# Altium schematic sheet lab2_Kondrashova_buck_boost.SchDoc: =title_line_1 + title_line_2
size 420 x 297 mm; SheetNumber: n
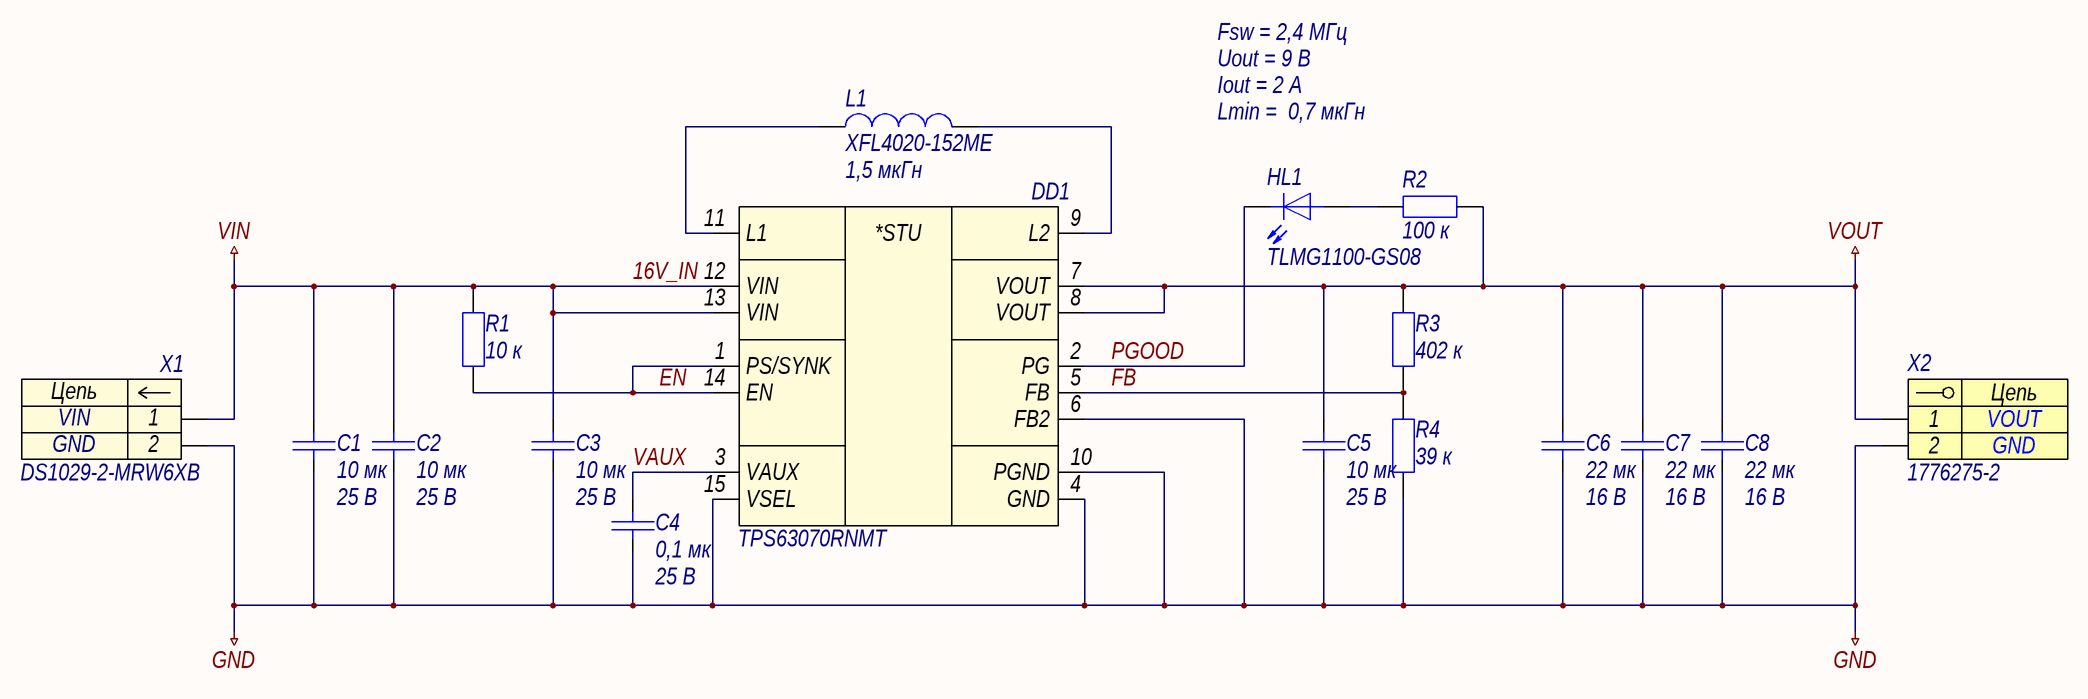
[diagram p0: lab2_Kondrashova_buck_boost.SchDoc]

## Parts
C1  10 мк  Напряжение: 25 В  [C1206]
C2  10 мк  Напряжение: 25 В  [C1206]
C3  10 мк  Напряжение: 25 В  [C0603]
C4  0,1 мк  Напряжение: 25 В  [C0402]
C5  10 мк  Напряжение: 25 В  [C0603]
C6  22 мк  Напряжение: 16 В  [C0805]
C7  22 мк  Напряжение: 16 В  [C0805]
C8  22 мк  Напряжение: 16 В  [C0805]
DD1  TPS63070RNMT  [VQFN-HR-15]
HL1  TLMG1100-GS08  [HL0603]
L1  XFL4020-152ME  Индуктивность: 1,5 мкГн  [XFL-2-400X400X210]
R1  10 к  [R0603]
R2  100 к  [R0603]
R3  402 к  [R0603]
R4  39 к  [R0603]
X1  DS1029-2-MRW6XB  [DS1029-2-MRW6XB]
X2  1776275-2  [1776275-2]

## Nets
16V_IN: C1.1 C2.1 C3.1 DD1.12(VIN) DD1.13(VIN) R1.1 X1.1  [also labelled VIN]
GND: C1.2 C2.2 C3.2 C4.2 C5.2 C6.1 C7.1 C8.1 DD1.4(GND) DD1.6(FB2) DD1.10(PGND) DD1.15(VSEL) R4.2 X1.2 X2.2
VOUT: C5.1 C6.2 C7.2 C8.2 DD1.7(VOUT) DD1.8(VOUT) R2.1 R3.1 X2.1
EN: DD1.1(PS/SYNK) DD1.14(EN) R1.2
FB: DD1.5(FB) R3.2 R4.1
PGOOD: DD1.2(PG) HL1.1
VAUX: C4.1 DD1.3(VAUX)
NetDD1_9: DD1.9(L2) L1.2
NetDD1_11: DD1.11(L1) L1.1
NetHL1_2: HL1.2 R2.2

## Notes on the sheet
- Fsw = 2,4 МГц
- Uout = 9 В
- Iout = 2 А
- Lmin =  0,7 мкГн
- Перв. примен.
- Справ. №
- Подп. и дата
- Инв. № дубл.
- Нормоконтроль:
- Взам. инв. №
- Изм.
- Лист
- № докум.
- Подп.
- Дата
- Лит.
- Масса
- Масштаб
- Т.контр.
- Пров.
- Разраб.
- Листов
- Разработал:
- Инв. № подл.
- Н.контр.
- Утв.
- Копировал
- Формат
- А3
- (in symbol dd0014) *STU
- (in symbol x0005) Цепь
- (in symbol x0007) Цепь

## Library data of the parts
C1 C2 = c0095: =Описание; ID: c0095; Фамилия: Паньков; Описание: Конденсатор чип 1206 10 мкФ 25 В ±10 %; Наименование: CC1206KRX7R8BB475; Производитель: YAGEO Corp.; Отклонение: ±10 %; Рабочие температуры: от –55 °С до +125 °С; Температурный коэффициент емкости: X7R; Корпус: 1206; Номинал: 10 мк; Номинальное напряжение: 25 В; HelpURL: https://www.yageo.com/upload/media/product/productsearch/datasheet/mlcc/UPY-GPHC_X7R_6.3V-to-50V_20.pdf
C3 C5 = c0090: =Описание; ID: c0090; Фамилия: Паньков; Описание: Конденсатор чип 0603 10 мкФ 25 В ±10 %; Наименование: CC0603KRX5R8BB106; Производитель: YAGEO Corp.; Отклонение: ±10 %; Рабочие температуры: от –55 °С до +85 °С; Температурный коэффициент емкости: X5R; Корпус: 0603; Номинал: 10 мк; Номинальное напряжение: 25 В; HelpURL: https://www.yageo.com/upload/media/product/productsearch/datasheet/mlcc/UPY-GPHC_X5R_4V-to-50V_26.pdf
C4 = c0029: =Описание; ID: c0029; Фамилия: Паньков; Описание: Конденсатор чип 0402 100 нФ 25 В ±10 %; Наименование: CC0402KRX5R8BB104; Производитель: YAGEO Corp.; Отклонение: ±10 %; Рабочие температуры: от –55 °С до +85 °С; Температурный коэффициент емкости: X5R; Корпус: 0402; Номинал: 0,1 мк; Номинальное напряжение: 25 В; HelpURL: https://www.yageo.com/upload/media/product/productsearch/datasheet/mlcc/UPY-GPHC_X5R_4V-to-50V_26.pdf
C6-C8 = c0100: =Описание; ID: c0100; Фамилия: Паньков; Описание: Конденсатор чип 0805 22 мкФ 16 В ±10 %; Наименование: CC0805KRX5R7BB226; Производитель: YAGEO Corp.; Отклонение: ±10 %; Рабочие температуры: от –55 °С до +85 °С; Температурный коэффициент емкости: X5R; Корпус: 0805; Номинал: 22 мк; Номинальное напряжение: 16 В; HelpURL: https://www.yageo.com/upload/media/product/productsearch/datasheet/mlcc/UPY-GPHC_X5R_4V-to-50V_26.pdf
DD1 = dd0014: =Описание; ID: dd0014; Фамилия: Кондрашова; Описание: Повышающий/понижающий преобразователь напряжения 16 В и 2 А; Производитель: Texas Instruments; Входное напряжение: от 2 В до 16 В; Выходное напряжение: от 2,5 В до 9 В; Коммутируемый ток: до 2 А; Частота переключения: от 2,1 МГц до 2,8 МГц; Рабочие температуры: от –40 °С до +125 °С; Наименование: TPS63070RNMT; Корпус: VQFN-HR-15; HelpURL: https://www.ti.com/product/TPS63070
HL1 = hl0005: =Описание; ID: hl0005; Фамилия: Ларионов; Описание: Светодиод чип 0603 зеленый; Производитель: Vishay Intertechnology, Inc.; Цвет: Green; Номинальная сила света: 35 мкд; Номинальная длина волны: 570 нм; Номинальный прямой ток: 30 мА; Номинальное падение напряжения: 2,1 В; Рассеиваемая мощность: 90 мВт; Рабочие температуры: от -40 °С до +100 °С; Корпус: 0603; Наименование: TLMG1100-GS08; HelpURL: https://www.vishay.com/leds/list/product-83173/
L1 = l0001: =Описание; ID: l0001; Фамилия: Кондрашова; Описание: Катушка индуктивности 1,5 мкГн ±20 %; Производитель: Coilcraft, Inc.; Отклонение: ±20 %; Номинальное активное сопротивление: 14,4 мОм; Максимальное активное сопротивление: 15,8 мОм; Резонансная частота: 59 МГц; Номинальный ток (при нагреве на 20 °С/40 °С): 9,1 А; Ток насыщения: 4,4 А; Рабочее напряжение: от 0 В до 20 В; Рабочие температуры: от –40 °С до +125 °С; Корпус: 4,0 x 4,0 x 2,1; Наименование: XFL4020-152ME; Номинал: 1,5 мкГн; HelpURL: https://www.coilcraft.com/en-us/products/power/shielded-inductors/molded-inductor/xfl/xfl4020/
R1 = r0060: =Описание; ID: r0060; Фамилия: Самарин; Описание: Резистор чип 0603 10 кОм ±1 % 0,1 Вт; Наименование: RC0603FR-0710KL; Производитель: YAGEO Corp.; Отклонение: ±1 %; Номинальное напряжение: 75 В; Рабочие температуры: от –55 °С до +155 °С; Номинальный ток: 1 А; Корпус: 0603; Номинал: 10 к; HelpURL: https://www.yageo.com/upload/media/product/productsearch/datasheet/rchip/PYu-RC_Group_51_RoHS_L_11.pdf
R2 = r0094: =Описание; ID: r0094; Фамилия: Водорезов; Описание: Резистор чип 0603 100 кОм ±1 % 0,1 Вт; Наименование: RC0603FR-07100KL; Производитель: YAGEO Corp.; Отклонение: ±1 %; Номинальное напряжение: 75 В; Рабочие температуры: от –55 °С до +155 °С; Номинальный ток: 1 А; Корпус: 0603; Номинал: 100 к; HelpURL: https://www.yageo.com/upload/media/product/productsearch/datasheet/rchip/PYu-RC_Group_51_RoHS_L_11.pdf
R3 = r0129: =Описание; ID: r0129; Фамилия: Паньков; Описание: Резистор чип 0603 402 кОм ±1 % 0,1 Вт; Наименование: RC0603FR-07402RL; Производитель: YAGEO Corp.; Отклонение: ±1 %; Номинальное напряжение: 75 В; Рабочие температуры: от –55 °С до +155 °С; Номинальный ток: 1 А; Корпус: 0603; Номинал: 402 к; HelpURL: https://www.yageo.com/upload/media/product/productsearch/datasheet/rchip/PYu-RC_Group_51_RoHS_L_11.pdf
R4 = r0079: =Описание; ID: r0079; Фамилия: Паньков; Описание: Резистор чип 0603 39 кОм ±1 % 0,1 Вт; Наименование: RC0603FR-0739KL; Производитель: YAGEO Corp.; Отклонение: ±1 %; Номинальное напряжение: 75 В; Рабочие температуры: от –55 °С до +155 °С; Номинальный ток: 1 А; Корпус: 0603; Номинал: 39 к; HelpURL: https://www.yageo.com/upload/media/product/productsearch/datasheet/rchip/PYu-RC_Group_51_RoHS_L_11.pdf
X1 = x0007: =Описание; Contact_1: VIN; Contact_2: GND; ID: x0007; Фамилия: Ларионов; Описание: CWF 2 pin Type B 2,5 мм вилка угловой; Производитель: Connfly Electronic Co. LTD.; Наименование: DS1029-2-MRW6XB; HelpURL: http://www.connfly.com/productshow.aspx?id=352
X2 = x0005: =Описание; Contact_1: VOUT; Contact_2: GND; ID: x0005; Фамилия: Паньков; Описание: Terminal Block 2 pin 3,5 мм; Производитель: TE Connectivity; Наименование: 1776275-2; HelpURL: https://www.te.com/usa-en/product-1776275-2.html